# EAGLE design RELAYULN (EAGLE 7.6.0)
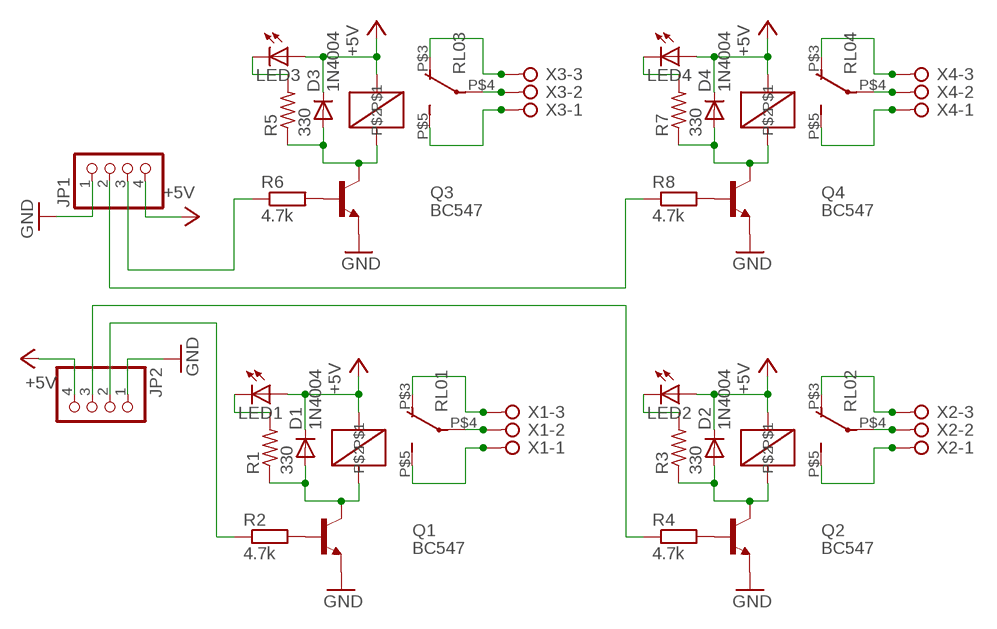
[diagram p0: schematic, sheet 1]

## Parts
D1  1N4004  [DO41-10]
D2  1N4004  [DO41-10]
D3  1N4004  [DO41-10]
D4  1N4004  [DO41-10]
JP1  PINHD-1X4  [1X04]
JP2  PINHD-1X4  [1X04]
LED1  LED3MM  [LED3MM]
LED2  LED3MM  [LED3MM]
LED3  LED3MM  [LED3MM]
LED4  LED3MM  [LED3MM]
Q1  BC547  [TO92]
Q2  BC547  [TO92]
Q3  BC547  [TO92]
Q4  BC547  [TO92]
R1  330  R-US_0207/7  [0207/7]
R2  4.7k  R-EU_0207/7  [0207/7]
R3  330  R-US_0207/7  [0207/7]
R4  4.7k  R-EU_0207/7  [0207/7]
R5  330  R-US_0207/7  [0207/7]
R6  4.7k  R-EU_0207/7  [0207/7]
R7  330  R-US_0207/7  [0207/7]
R8  4.7k  R-EU_0207/7  [0207/7]
RL01  RELAY01  [RELAY01]
RL02  RELAY01  [RELAY01]
RL03  RELAY01  [RELAY01]
RL04  RELAY01  [RELAY01]
X1  W237-3E  [W237-3E]
X2  W237-3E  [W237-3E]
X3  W237-3E  [W237-3E]
X4  W237-3E  [W237-3E]

## Nets
+5V: D1.C D2.C D3.C D4.C JP1.4 JP2.4 LED1.A LED2.A LED3.A LED4.A RL01.P$2 RL02.P$2 RL03.P$2 RL04.P$2
GND: JP1.1 JP2.1 Q1.1(E) Q2.1(E) Q3.1(E) Q4.1(E)
N$1: RL02.P$3(O) X2.3
N$2: RL02.P$4(P) X2.2
N$3: RL02.P$5(S) X2.1
N$4: RL01.P$3(O) X1.3
N$5: RL01.P$4(P) X1.2
N$6: RL01.P$5(S) X1.1
N$7: LED1.K(C) R1.2
N$8: LED2.K(C) R3.2
N$9: D1.A Q1.3(C) R1.1 RL01.P$1
N$10: Q1.2(B) R2.2
N$11: D2.A Q2.3(C) R3.1 RL02.P$1
N$12: Q2.2(B) R4.2
N$13: JP2.3 R4.1
N$14: RL03.P$3(O) X3.3
N$15: RL03.P$4(P) X3.2
N$16: RL03.P$5(S) X3.1
N$17: LED3.K(C) R5.2
N$18: D3.A Q3.3(C) R5.1 RL03.P$1
N$19: Q3.2(B) R6.2
N$20: JP1.3 R6.1
N$21: RL04.P$3(O) X4.3
N$22: RL04.P$4(P) X4.2
N$23: RL04.P$5(S) X4.1
N$24: LED4.K(C) R7.2
N$25: D4.A Q4.3(C) R7.1 RL04.P$1
N$26: Q4.2(B) R8.2
N$27: JP1.2 R8.1
N$31: JP2.2 R2.1

## Library data of the parts
D1-D4 = adafruit:1N4004: DIODE General purpose 1N400x type rectifier (With bigger pads) http://www.ladyada.net/library/pcb/eaglelibrary.html
JP1 JP2 = pinhead:PINHD-1X4: PIN HEADER
LED1-LED4 = led:LED: LED OSRAM: - CHIPLED LG R971, LG N971, LY N971, LG Q971, LY Q971, LO R971, LY R971 LH N974, LH R974 LS Q976, LO Q976, LY Q976 LO Q996 - Hyper CHIPLED LW Q18S LB Q993, LB Q99A, LB R99A - SideLED LS A670, LO A670, LY A670, LG A670, LP A670 LB A673, LV A673, LT A673, LW A673 LH A674 LY A675 LS A676, LA A676, LO A676, LY A676, LW A676 LS A679, LY A679, LG A679 - Hyper Micro SIDELED® LS Y876, LA Y876, LO Y876, LY Y876 LT Y87S - SmartLED LW L88C, LW L88S LB L89C, LB L89S, LG L890 LS L89K, LO L89K, LY L89K LS L896, LA L896, LO L896, LY L896 - TOPLED LS T670, LO T670, LY T670, LG T670, LP T670 LSG T670, LSP T670, LSY T670, LOP T670, LYG T670 LG T671, LOG T671, LSG T671 LB T673, LV T673, LT T673, LW T673 LH T674 LS T676, LA T676, LO T676, LY T676, LB T676, LH T676, LSB T676, LW T676 LB T67C, LV T67C, LT T67C, LS T67K, LO T67K, LY T67K, LW E67C LS E67B, LA E67B, LO E67B, LY E67B, LB E67C, LV E67C, LT E67C LW T67C LS T679, LY T679, LG T679 LS T770, LO T770, LY T770, LG T770, LP T770 LB T773, LV T773, LT T773, LW T773 LH T774 LS E675, LA E675, LY E675, LS T675 LS T776, LA T776, LO T776, LY T776, LB T776 LHGB T686 LT T68C, LB T68C - Hyper Mini TOPLED® LB M676 - Mini TOPLED Santana® LG M470 LS M47K, LO M47K, LY M47K Source: http://www.osram.convergy.de LUXEON: - LUMILED® LXK2-PW12-R00, LXK2-PW12-S00, LXK2-PW14-U00, LXK2-PW14-V00 LXK2-PM12-R00, LXK2-PM12-S00, LXK2-PM14-U00 LXK2-PE12-Q00, LXK2-PE12-R00, LXK2-PE12-S00, LXK2-PE14-T00, LXK2-PE14-U00 LXK2-PB12-K00, LXK2-PB12-L00, LXK2-PB12-M00, LXK2-PB14-N00, LXK2-PB14-P00, LXK2-PB14-Q00 LXK2-PR12-L00, LXK2-PR12-M00, LXK2-PR14-Q00, LXK2-PR14-R00 LXK2-PD12-Q00, LXK2-PD12-R00, LXK2-PD12-S00 LXK2-PH12-R00, LXK2-PH12-S00 LXK2-PL12-P00, LXK2-PL12-Q00, LXK2-PL12-R00 Source: www.luxeon.com KINGBRIGHT: KA-3528ASYC Source: www.kingbright.com
Q1-Q4 = transistor-npn:BC547*: NPN Transistor
R1 R3 R5 R7 = resistor:R-US_: RESISTOR, American symbol
R2 R4 R6 R8 = resistor:R-EU_: RESISTOR, European symbol
RL01-RL04 = ARPITSLIB:RELAY01
X1-X4 = con-wago-508:W237-3E: WAGO SREW CLAMP; OC_FARNELL: unknown; OC_NEWARK: unknown

## Board
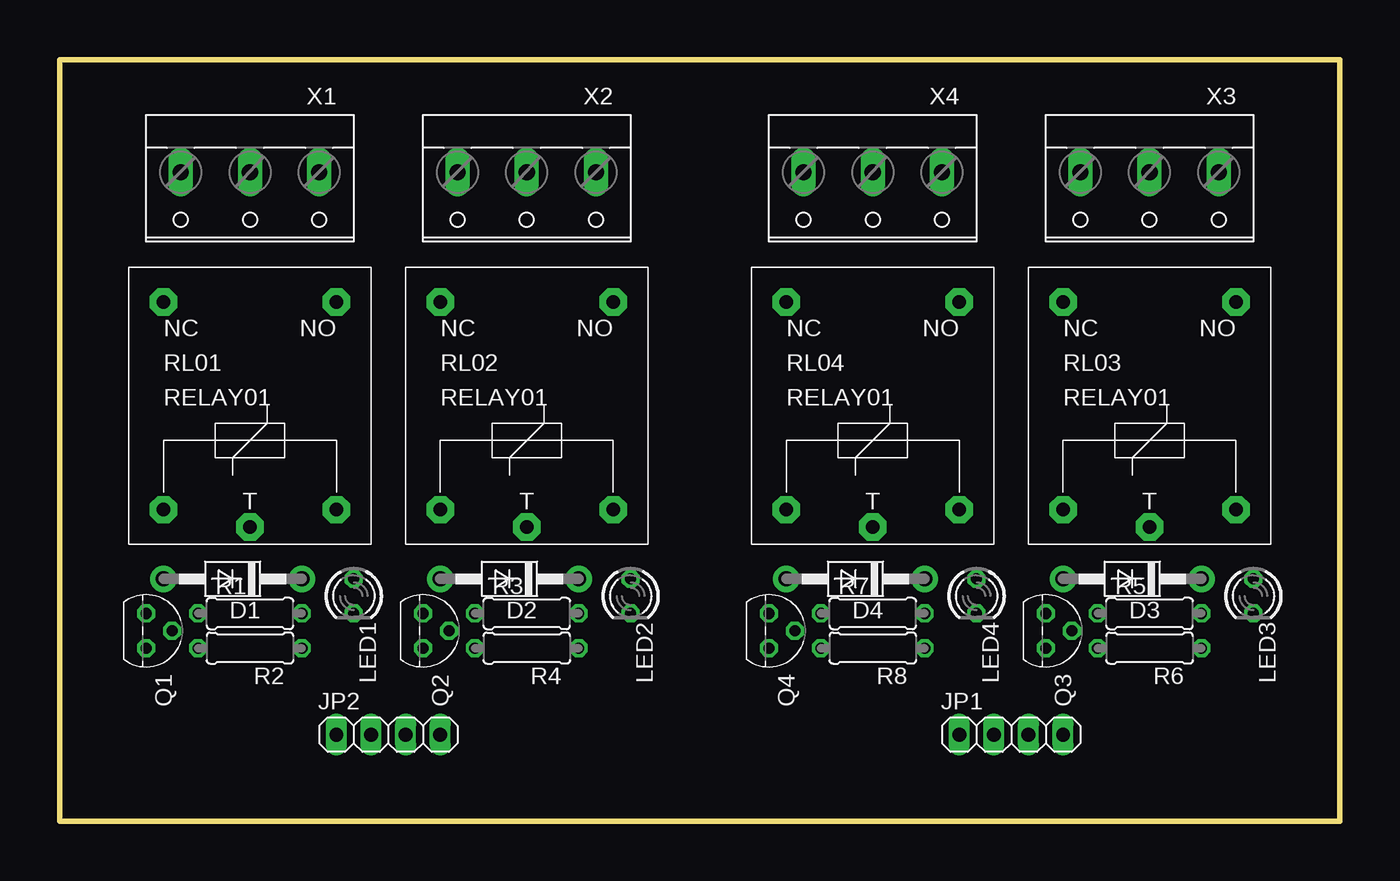
[diagram p1: board, top side]
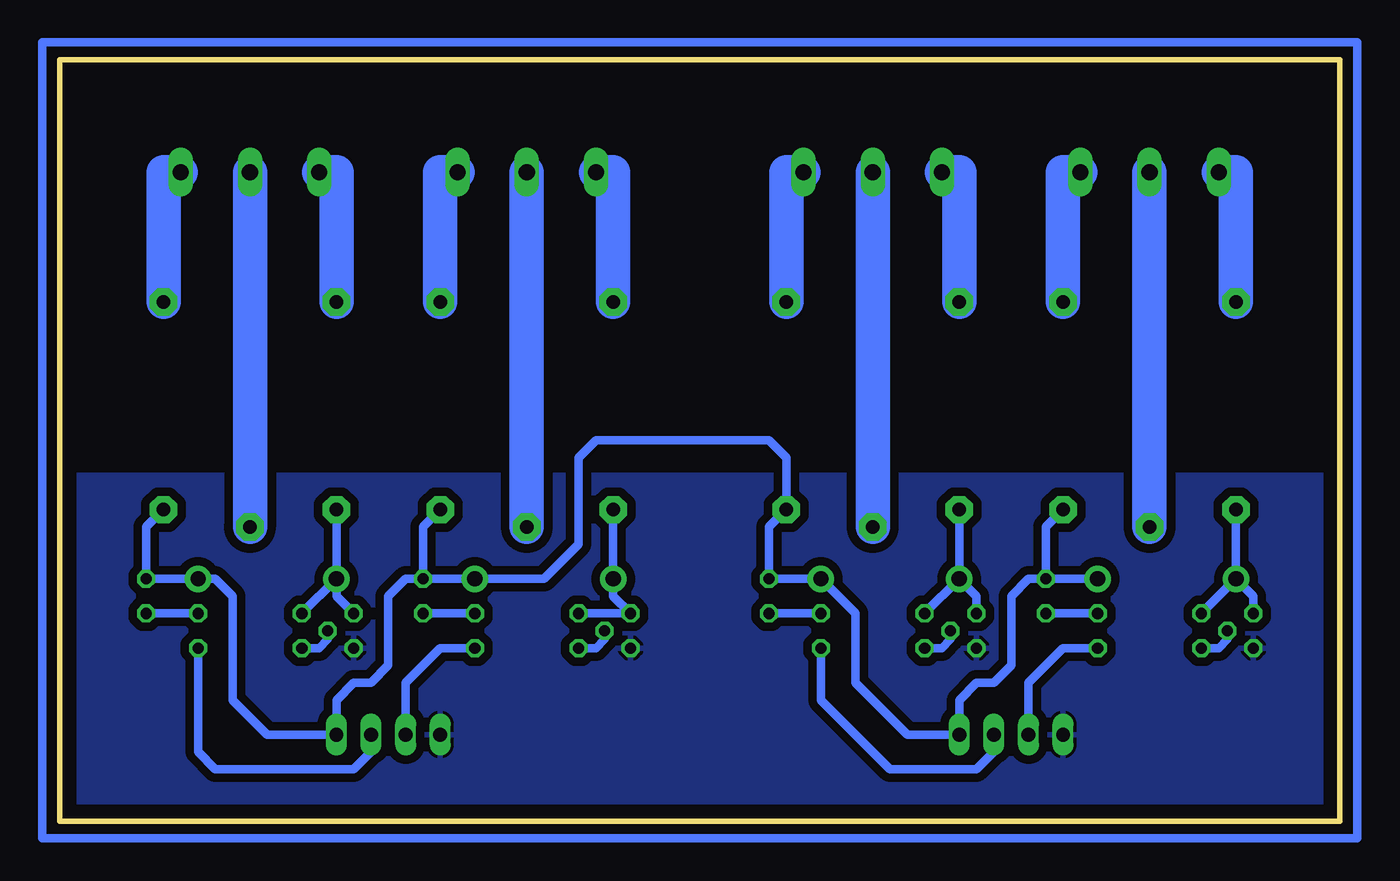
[diagram p2: board, bottom side, seen from below]

Size 93.98 x 55.88 mm. Coordinates in mm from the lower left corner, seen from the top.
Outline: 0,0 93.98,0 93.98,55.88 0,55.88 0,0
Copper layers (1*16): Top 0.035mm / dielectric 1.5mm / Bottom 0.035mm
Design rules "default": minimum track width 10mil, minimum drill 24mil, track to track 8mil, track to pad 8mil, pad to pad 8mil, via to via 8mil, smd to smd 8mil, copper to edge 40mil, drill to drill 8mil, minimum pad ring 10mil, minimum via ring 8mil, stop-mask expansion 4mil, vias tented up to drill 0mil, thermal gap 10mil

### Footprints (pad centres in the part's own frame; a part is rotated, then mirrored left to right if it is on the bottom)
DO41-10 = drill 1.118 pad 1.93: A 5.08,0; C -5.08,0
1X04 = drill 1.016 long: 1 -3.81,0; 2 -1.27,0; 3 1.27,0; 4 3.81,0
LED3MM = drill 0.813 octagon: A -1.27,0; K 1.27,0
TO92 = drill 0.813 octagon: 1 1.27,0; 2 0,1.905; 3 -1.27,0
0207/7 = drill 0.813 octagon: 1 -3.81,0; 2 3.81,0
RELAY01 = drill 1 pad 2 octagon: P$1 0,0; P$2 12.7,0; P$3 0,15.24; P$4 6.35,-1.27; P$5 12.7,15.24
W237-3E = drill 1.194 long: 1 -5.08,-0.635; 2 0,-0.635; 3 5.08,-0.635

### Placement (x,y rotation side)
D1  12.7,17.78 180 top
D2  33.02,17.78 180 top
D3  78.74,17.78 180 top
D4  58.42,17.78 180 top
JP1  69.85,6.35 0 top
JP2  24.13,6.35 0 top
LED1  21.59,16.51 270 top
LED2  41.91,16.51 270 top
LED3  87.63,16.51 270 top
LED4  67.31,16.51 270 top
Q1  6.35,13.97 270 top
Q2  26.67,13.97 270 top
Q3  72.39,13.97 270 top
Q4  52.07,13.97 270 top
R1  13.97,15.24 0 top
R2  13.97,12.7 180 top
R3  34.29,15.24 0 top
R4  34.29,12.7 180 top
R5  80.01,15.24 0 top
R6  80.01,12.7 180 top
R7  59.69,15.24 0 top
R8  59.69,12.7 180 top
RL01  7.62,22.86 0 top
RL02  27.94,22.86 0 top
RL03  73.66,22.86 0 top
RL04  53.34,22.86 0 top
X1  13.97,46.99 180 top
X2  34.29,46.99 180 top
X3  80.01,46.99 180 top
X4  59.69,46.99 180 top

### Tracks (layer width: path | path; a pad name or v marks a point on that pad's centre or on a via)
+5V
  Bottom 0.61: LED4.A D4.C 58.42,17.78 55.88,20.32 55.88,26.67 54.61,27.94 41.91,27.94 40.64,26.67 RL02.P$2 41.91,21.59 LED2.A D2.C 35.56,15.24 35.56,10.16 31.75,6.35 JP2.4 27.94,8.89 26.67,10.16 25.4,10.16 24.13,11.43 24.13,16.51 22.86,17.78 LED1.A | RL03.P$2 87.63,21.59 LED3.A D3.C 82.55,17.78 81.28,16.51 81.28,8.89 78.74,6.35 JP1.4 73.66,8.89 72.39,10.16 71.12,10.16 69.85,11.43 69.85,16.51 68.58,17.78 LED4.A | RL04.P$2 67.31,21.59 LED4.A | RL01.P$2 21.59,21.59 LED1.A | LED1.A D1.C
GND
  pour Bottom (isolate 0.635): 1.27,25.4 92.71,25.4 92.71,1.27 1.27,1.27
N$1
  Bottom 2.54: X2.3 27.94,47.62 RL02.P$3
N$2
  Bottom 2.54: RL02.P$4 X2.2
N$3
  Bottom 2.54: X2.1 40.64,47.62 RL02.P$5
N$4
  Bottom 2.54: X1.3 7.62,47.62 RL01.P$3
N$5
  Bottom 2.54: X1.2 RL01.P$4
N$6
  Bottom 2.54: X1.1 20.32,47.62 RL01.P$5
N$7
  Bottom 0.61: R1.2 LED1.K
N$8
  Bottom 0.61: R3.2 LED2.K
N$9
  Bottom 0.61: Q1.3 6.35,16.51 D1.A | R1.1 D1.A | D1.A RL01.P$1
N$10
  Bottom 0.61: Q1.2 8.26,13.34 8.89,12.7 R2.2
N$11
  Bottom 0.61: R3.1 D2.A | D2.A RL02.P$1 | Q2.3 26.67,16.51 D2.A
N$12
  Bottom 0.61: Q2.2 28.57,13.34 29.21,12.7 R4.2
N$13
  Bottom 0.61: JP2.3 25.4,5.08 26.67,3.81 33.02,3.81 38.1,8.89 R4.1
N$14
  Bottom 2.54: X3.3 73.66,47.62 RL03.P$3
N$15
  Bottom 2.54: X3.2 RL03.P$4
N$16
  Bottom 2.54: X3.1 86.36,47.62 RL03.P$5
N$17
  Bottom 0.61: LED3.K R5.2
N$18
  Bottom 0.61: D3.A 73.66,16.51 Q3.3 | R5.1 D3.A | D3.A RL03.P$1
N$19
  Bottom 0.61: Q3.2 74.3,13.34 74.93,12.7 R6.2
N$20
  Bottom 0.61: R6.1 83.82,5.08 82.55,3.81 72.39,3.81 71.12,5.08 JP1.3
N$21
  Bottom 2.54: X4.3 53.34,47.62 RL04.P$3
N$22
  Bottom 2.54: X4.2 RL04.P$4
N$23
  Bottom 2.54: X4.1 66.04,47.62 RL04.P$5
N$24
  Bottom 0.61: R7.2 LED4.K
N$25
  Bottom 0.61: RL04.P$1 D4.A 53.34,16.51 Q4.3 R7.1
N$26
  Bottom 0.61: Q4.2 53.97,13.34 54.61,12.7 R8.2
N$27
  Bottom 0.61: R8.1 66.04,12.7 68.58,10.16 JP1.2
N$28
  Bottom 0.61: -1.27,-1.27 -1.27,57.15 95.25,57.15 95.25,-1.27 -1.27,-1.27
N$31
  Bottom 0.61: R2.1 20.32,12.7 22.86,10.16 JP2.2